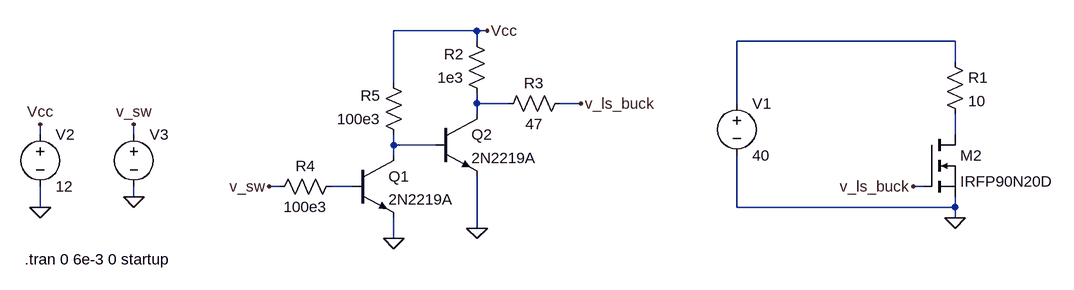
[diagram p0: schematic driver.asc]
driver.asc, the LTspice schematic file:
Version 4
SHEET 1 1656 724
WIRE -672 -320 -800 -320
WIRE -656 -320 -672 -320
WIRE -672 -304 -672 -320
WIRE 64 -304 -272 -304
WIRE 64 -272 64 -304
WIRE -800 -240 -800 -320
WIRE -672 -208 -672 -224
WIRE -624 -208 -672 -208
WIRE -512 -208 -544 -208
WIRE -272 -208 -272 -304
WIRE -672 -192 -672 -208
WIRE -1344 -160 -1344 -176
WIRE -1200 -160 -1200 -176
WIRE 64 -160 64 -192
WIRE -800 -144 -800 -160
WIRE -736 -144 -800 -144
WIRE -800 -128 -800 -144
WIRE -976 -80 -992 -80
WIRE -864 -80 -896 -80
WIRE 16 -80 0 -80
WIRE -1200 -64 -1200 -80
WIRE -1344 -48 -1344 -80
WIRE -272 -48 -272 -128
WIRE 64 -48 64 -64
WIRE 64 -48 -272 -48
WIRE 64 -32 64 -48
WIRE -672 -16 -672 -96
WIRE -800 0 -800 -32
FLAG 64 -32 0
FLAG 0 -80 v_ls_buck
FLAG -672 -16 0
FLAG -1200 -64 0
FLAG -512 -208 v_ls_buck
FLAG -800 0 0
FLAG -1344 -176 Vcc
FLAG -1344 -48 0
FLAG -1200 -176 v_sw
FLAG -992 -80 v_sw
FLAG -656 -320 Vcc
SYMBOL voltage -272 -224 R0
WINDOW 123 0 0 Left 0
WINDOW 39 0 0 Left 0
SYMATTR InstName V1
SYMATTR Value 40
SYMBOL nmos 16 -160 R0
SYMATTR InstName M2
SYMATTR Value IRFP90N20D
SYMBOL res 48 -288 R0
SYMATTR InstName R1
SYMATTR Value 10
SYMBOL npn -864 -128 R0
SYMATTR InstName Q1
SYMATTR Value 2N2219A
SYMBOL res -656 -208 R180
WINDOW 0 36 76 Left 2
WINDOW 3 36 40 Left 2
SYMATTR InstName R2
SYMATTR Value 1e3
SYMBOL res -880 -96 R90
WINDOW 0 0 56 VBottom 2
WINDOW 3 32 56 VTop 2
SYMATTR InstName R4
SYMATTR Value 100e3
SYMBOL voltage -1344 -176 R0
WINDOW 123 0 0 Left 0
WINDOW 39 0 0 Left 0
SYMATTR InstName V2
SYMATTR Value 12
SYMBOL voltage -1200 -176 R0
WINDOW 3 24 96 Invisible 2
WINDOW 123 0 0 Left 0
WINDOW 39 0 0 Left 0
SYMATTR Value PULSE(0 3.3 0 1e-9 1e-9 1e-3 2e-3)
SYMATTR InstName V3
SYMBOL npn -736 -192 R0
SYMATTR InstName Q2
SYMATTR Value 2N2219A
SYMBOL res -784 -144 R180
WINDOW 0 36 76 Left 2
WINDOW 3 36 40 Left 2
SYMATTR InstName R5
SYMATTR Value 100e3
SYMBOL res -528 -224 R90
WINDOW 0 0 56 VBottom 2
WINDOW 3 32 56 VTop 2
SYMATTR InstName R3
SYMATTR Value 47
TEXT -1368 32 Left 2 !.tran 0 6e-3 0 startup

The netlist it stands for:
* driver.asc
V1 N001 0 40
M2 N003 v_ls_buck 0 0 IRFP90N20D
R1 N001 N003 10
Q1 N004 N005 0 0 2N2219A
R2 N002 Vcc 1e3
R4 N005 v_sw 100e3
V2 Vcc 0 12
V3 v_sw 0 PULSE(0 3.3 0 1e-9 1e-9 1e-3 2e-3)
Q2 N002 N004 0 0 2N2219A
R5 N004 Vcc 100e3
R3 v_ls_buck N002 47
.model NPN NPN
.model PNP PNP
.lib standard.bjt
.model NMOS NMOS
.model PMOS PMOS
.lib standard.mos
.tran 0 6e-3 0 startup
.backanno
.end